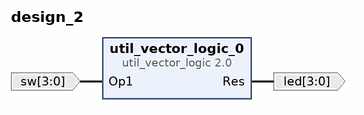
[diagram p0: block diagram of the top level]
# Vivado block design design_2, xc7a35ticsg324-1L, Vivado 2020.2
create_bd_design design_2

create_bd_port -dir I -from 3 -to 0 -type data sw
create_bd_port -dir O -from 3 -to 0 led

create_bd_cell -type ip -vlnv xilinx.com:ip:util_vector_logic:2.0 util_vector_logic_0
set_property -dict {CONFIG.C_OPERATION not CONFIG.C_SIZE 4} [get_bd_cells util_vector_logic_0]

# ---- connections ----

connect_bd_net [get_bd_ports sw] [get_bd_pins util_vector_logic_0/Op1]
connect_bd_net [get_bd_pins util_vector_logic_0/Res] [get_bd_ports led]

validate_bd_design
save_bd_design
